# Altium project PCB.PrjPcb
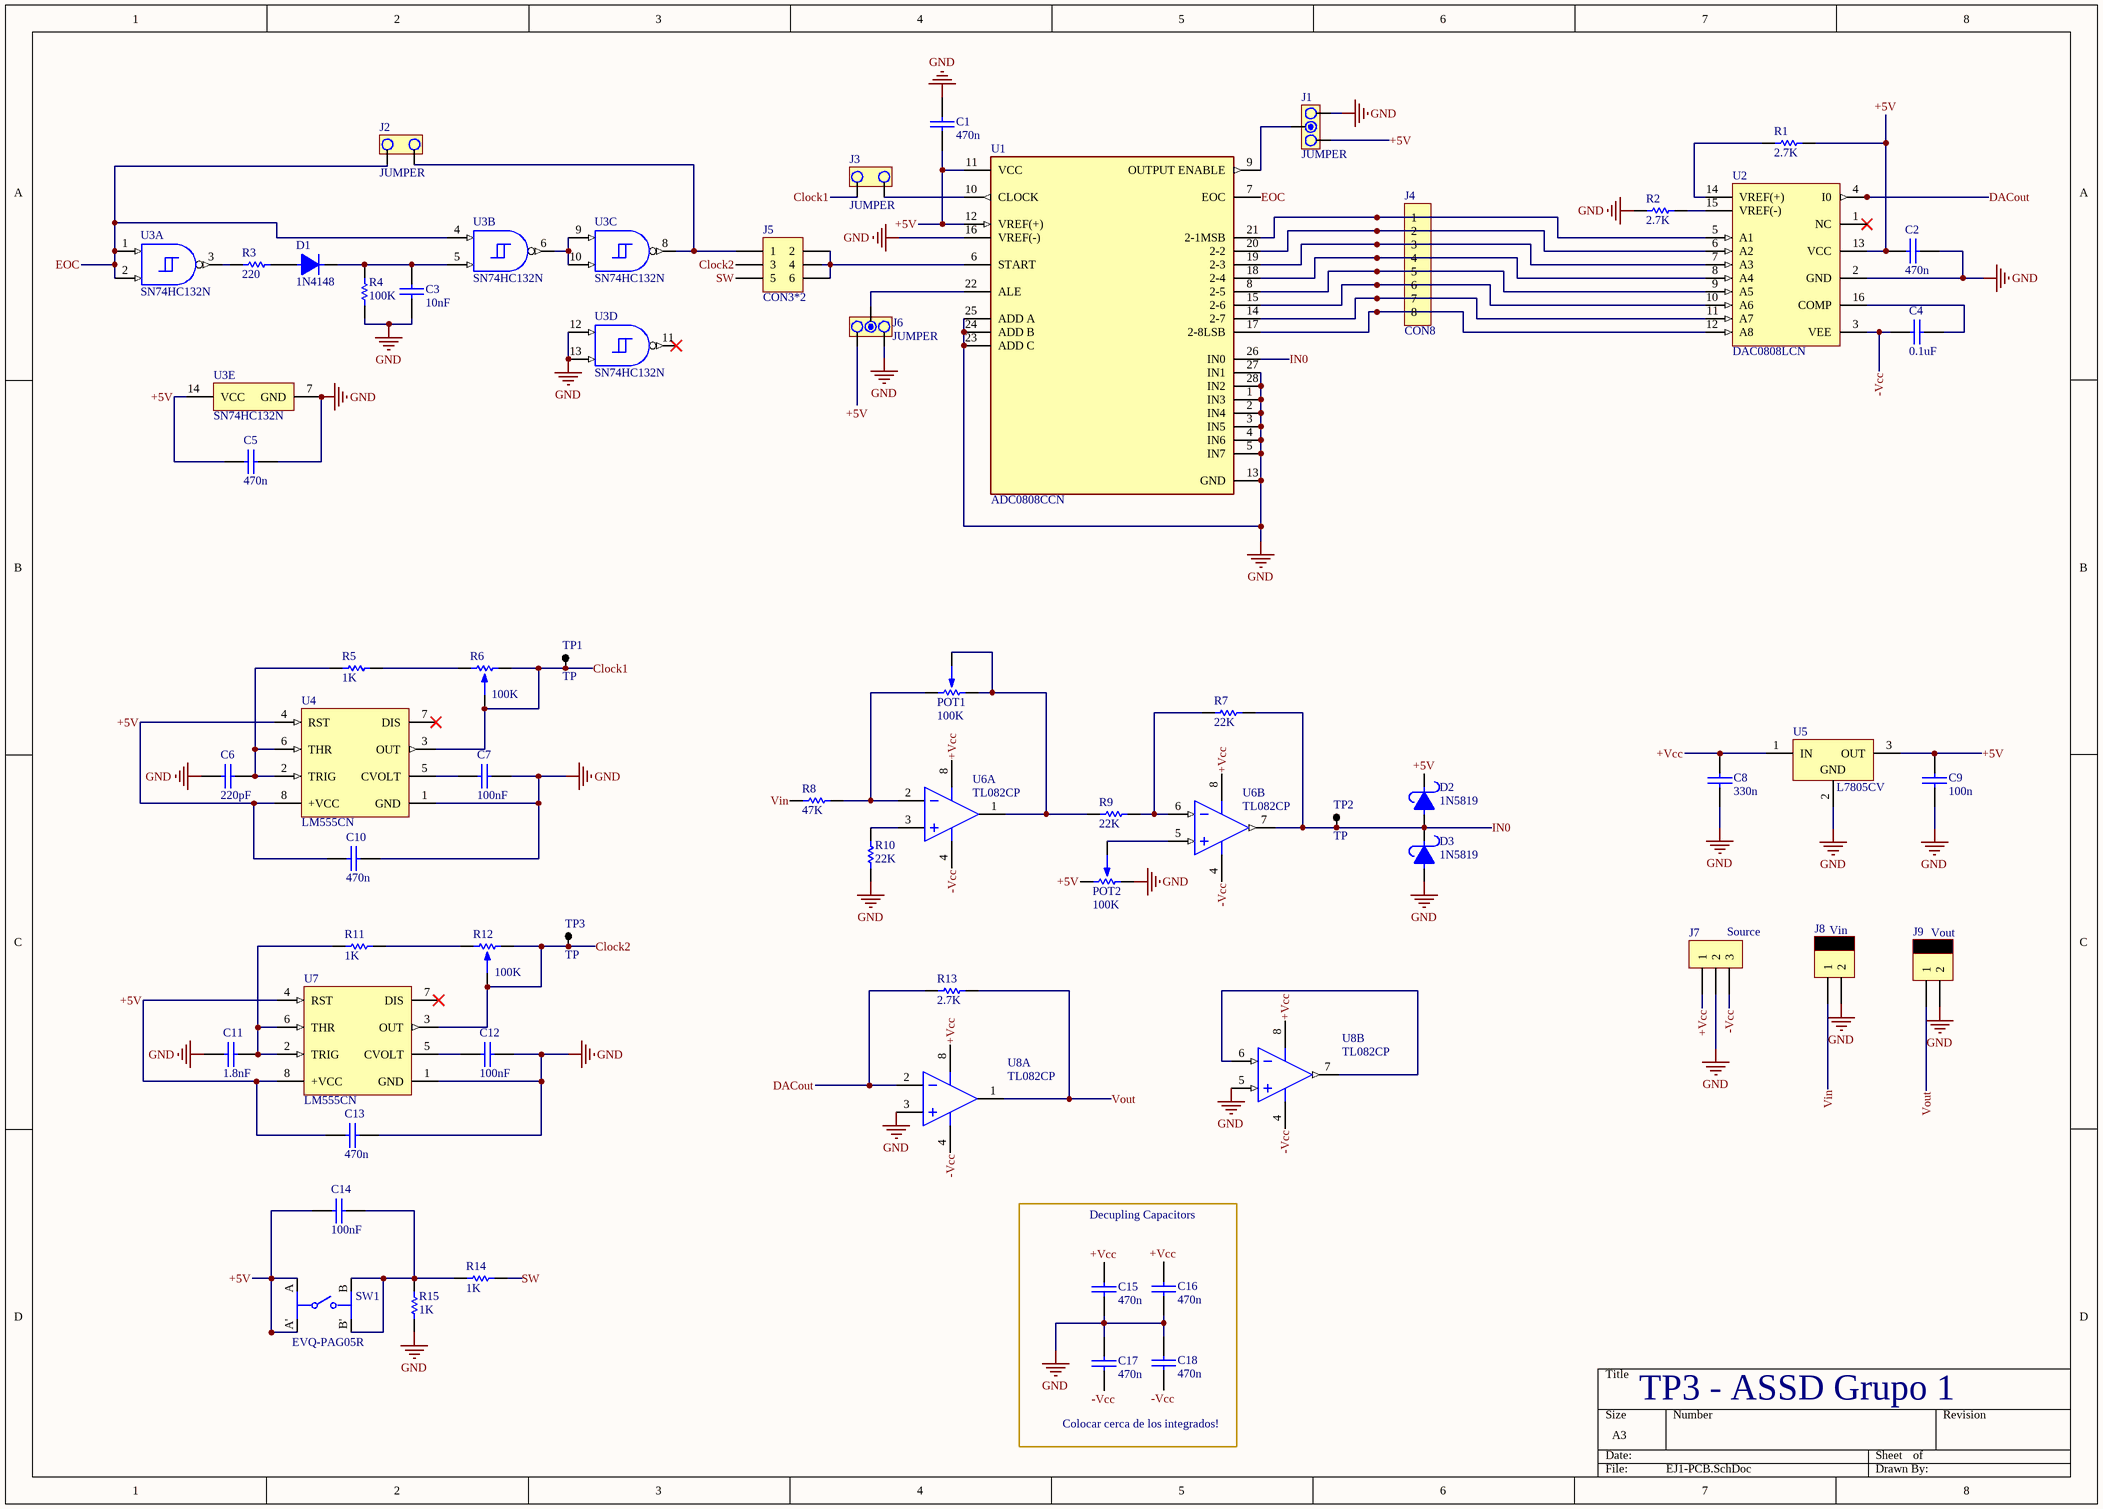
[diagram p0: EJ1-PCB.SchDoc]
1 sheet, 59 parts. Net scope: global (net labels, ports and power ports of the same name join across sheets).
Board file: EJ1-PCB.PcbDoc

## Sheet EJ1-PCB.SchDoc
size A3; SheetNumber: 1; SheetTotal: 1

### Parts
C1  470n  [0805]
C2  470n  [0805]
C3  10nF  [0805]
C4  0.1uF  [0805]
C5  470n  [0805]
C6  220pF  [0805]
C7  100nF  [0805]
C8  330n  [0805]
C9  100n  [0805]
C10  470n  [0805]
C11  1.8nF  [0805]
C12  100nF  [0805]
C13  470n  [0805]
C14  100nF  [0805]
C15  470n  [0805]
C16  470n  [0805]
C17  470n  [0805]
C18  470n  [0805]
D1  1N4148  [DO41]
D2  1N5819  [DO41]
D3  1N5819  [DO41]
J1  JUMPER  [JUMPER3]
J2  JUMPER  [JUMPER2]
J3  JUMPER  [JUMPER2]
J4  CON8  [SIP8]
J5  CON3*2  [SIP3*2]
J6  JUMPER  [JUMPER3]
J7  Source  [BORNERA3]
J8  Vin  [MOLEX2]
J9  Vout  [MOLEX2]
POT1  100K  [PRESET V]
POT2  100K  [PRESET V]
R1  2.7K  [0805]
R2  2.7K  [0805]
R3  220  [0805]
R4  100K  [0805]
R5  1K  [0805]
R6  100K  [PRESET V]
R7  22K  [0805]
R8  47K  [0805]
R9  22K  [0805]
R10  22K  [0805]
R11  1K  [0805]
R12  100K  [PRESET V]
R13  2.7K  [0805]
R14  1K  [0805]
R15  1K  [0805]
SW1  EVQ-PAG05R  [FP-EVQ-PAG05R-MFG]
TP1  TP  [TPTH]
TP2  TP  [TPTH]
TP3  TP  [TPTH]
U1  ADC0808CCN  [FP-N0028A-MFG]
U2  DAC0808LCN  [NFG0016A]
U3  SN74HC132N  [N0014A]  (parts A,B,C,D,E of 5)
U4  LM555CN  [N08E]
U5  L7805CV  [TO220]
U6  TL082CP  [P0008A]  (parts A,B of 2)
U7  LM555CN  [N08E]
U8  TL082CP  [P0008A]  (parts A,B of 2)

### Nets
GND: C1.1 C2.2 C3.2 C5.2 C6.2 C7.2 C8.2 C9.2 C10.2 C11.2 C12.2 C13.2 C15.2 C16.2 C17.1 C18.1 D3.1 J1.1 J6.1 J7.2 J8.2 J9.2 POT2.3 R2.1 R4.1 R10.2 R15.1 U1.1(IN3) U1.2(IN4) U1.3(IN5) U1.4(IN6) U1.5(IN7) U1.13(GND) U1.16(VREF(-)) U1.23(ADD_C) U1.24(ADD_B) U1.25(ADD_A) U1.27(IN1) U1.28(IN2) U2.2(GND) U3.7(GND) U3.12(4A) U3.13(4B) U4.1(GND) U5.2(GND) U7.1(GND) U8.3(IN1+) U8.5(IN2+)
+5V: C1.2 C2.1 C5.1 C9.1 C10.1 C13.1 C14.2 D2.2 J1.3 J6.3 POT2.1 R1.2 SW1.A SW1.A' U1.11(VCC) U1.12(VREF(+)) U2.13(VCC) U3.14(VCC) U4.4(RST) U4.8(+VCC) U5.3(OUT) U7.4(RST) U7.8(+VCC)
+Vcc: C8.1 C15.1 C16.1 J7.1 U5.1(IN) U6.8(VCC+) U8.8(VCC+)
-Vcc: C4.1 C17.2 C18.2 J7.3 U2.3(VEE) U6.4(VCC-) U8.4(VCC-)
Clock1: J3.2 R6.1 R6.2 TP1.1 U4.3(OUT)
Clock2: J5.3 R12.1 R12.2 TP3.1 U7.3(OUT)
DACout: R13.1 U2.4(I0) U8.2(IN1-)
EOC: J2.2 U1.7(EOC) U3.1(1A) U3.2(1B) U3.4(2A)
IN0: D2.1 D3.2 R7.2 TP2.1 U1.26(IN0) U6.7(OUT2)
SW: J5.5 R14.1
Vin: J8.1 R8.1
Vout: J9.1 R13.2 U8.1(OUT1)
NetC3_1: C3.1 D1.2 R4.2 U3.5(2B)
NetC4_2: C4.2 U2.16(COMP)
NetC6_1: C6.1 R5.1 U4.2(TRIG) U4.6(THR)
NetC7_1: C7.1 U4.5(CVOLT)
NetC11_1: C11.1 R11.1 U7.2(TRIG) U7.6(THR)
NetC12_1: C12.1 U7.5(CVOLT)
NetC14_1: C14.1 R14.2 R15.2 SW1.B SW1.B'
NetD1_1: D1.1 R3.2
NetJ1_2: J1.2 U1.9(OUTPUT_ENABLE)
NetJ2_1: J2.1 J5.1 U3.8(3Y)
NetJ3_1: J3.1 U1.10(CLOCK)
NetJ4_1: J4.1 U1.21(2-1MSB) U2.5(A1)
NetJ4_2: J4.2 U1.20(2-2) U2.6(A2)
NetJ4_3: J4.3 U1.19(2-3) U2.7(A3)
NetJ4_4: J4.4 U1.18(2-4) U2.8(A4)
NetJ4_5: J4.5 U1.8(2-5) U2.9(A5)
NetJ4_6: J4.6 U1.15(2-6) U2.10(A6)
NetJ4_7: J4.7 U1.14(2-7) U2.11(A7)
NetJ4_8: J4.8 U1.17(2-8LSB) U2.12(A8)
NetJ5_2: J5.2 J5.4 J5.6 U1.6(START)
NetJ6_2: J6.2 U1.22(ALE)
NetPOT1_1: POT1.1 R8.2 U6.2(IN1-)
NetPOT1_2: POT1.2 POT1.3 R9.1 U6.1(OUT1)
NetPOT2_2: POT2.2 U6.5(IN2+)
NetR1_1: R1.1 U2.14(VREF(+))
NetR2_2: R2.2 U2.15(VREF(-))
NetR3_1: R3.1 U3.3(1Y)
NetR5_2: R5.2 R6.3
NetR7_1: R7.1 R9.2 U6.6(IN2-)
NetR10_1: R10.1 U6.3(IN1+)
NetR11_2: R11.2 R12.3
NetU3_6: U3.6(2Y) U3.9(3A) U3.10(3B)
NetU8_6: U8.6(IN2-) U8.7(OUT2)

Not connected (* = marked no-connect by the designer): U2 1(NC)*; U3 11(4Y)*; U4 7(DIS)*; U7 7(DIS)*

### Notes on the sheet
- Decupling Capacitors
- Colocar cerca de los integrados!
- TP3 - ASSD Grupo 1

### Library data of the parts
C1-C18 = CAP
D1 = DIODO
D2 D3 = DIODO SCHOTTKY
J1 J6 = JUMPER3
J2 = JUMPER: Just in case HC132 does not work
J7 = BORNERA 3
J8 J9 = MOLEX2
POT1 POT2 R6 R12 = PRESET
R1-R5 R7-R11 R13-R15 = RES
SW1 = CMP-05618-000039-1: SWITCH TACTILE SPST-NO 0.02A 15V; Electrical Life: 50000Cycles; Actuator Color: Red; Switch Function: Off-Mom; Actuator Type: Standard; Max Current Rating: 20mA; Contact Resistance: 50mR; Operating Force: 2.6N; Switch Travel: 0.25mm; Illumination Type: Non-Illuminated; Throw Configuration: SPST; Actuator Length: 1.6mm; Max Operating Temperature: 70°C; Mount: Through Hole; RoHS Compliant: Yes; Depth: 6.5mm; Radiation Hardening: No; Orientation: Straight; Width: 6mm; REACH SVHC: No SVHC; Voltage Rating (DC): 15V; Package Quantity: 500; Size: 6mm; Max Voltage Rating (DC): 15V; Mechanical Life: 50000Cycles; Contact Current Rating: 20mA; Contact Plating: Silver; Lead Free: Lead Free; Series: EVQPA; Height: 5mm; Length: 6mm; Min Operating Temperature: -20°C; Current Rating: 20mA; Termination: PC Pin; Packaging: Bulk
U1 = CMP-0054-00026-4: IC ADC 8BIT MPU 8CH MUX 28-DIP; Supply Type: Single; Power Consumption: 1.5mW; Input Type: SINGLE-ENDED; Number of Channels: 8; Number of Converters: 1; Conversion Rate: 10KS/s; Min Supply Voltage: 4.5V; Converter Type: GENERAL PURPOSE; Power Dissipation: 875mW; Operating Supply Voltage: 5V; Nominal Supply Current: 300uA; Resolution: 8b; Max Supply Voltage: 6V; Interface: Parallel; Polarity: Unipolar; Packaging: Rail/Tube; Min Operating Temperature: -40°C; Number of Inputs: 8; Mount: Through Hole; Radiation Hardening: No; Number of A/D Converters: 1; Width: 13.72mm; Number of Elements: 1; Max Operating Temperature: 85°C; Max Power Dissipation: 875mW; REACH SVHC: No SVHC; Number of Analog Inputs: 8; Lead Free: Contains Lead; Number of Pins: 28; Sampling Rate: 10KS/s; Package Quantity: 13; Number of Bits: 8; Height: 3.81mm; Case/Package: DIP; Length: 36.83mm
U2 = CMP-0061-00001-3: 8-Bit D/A Converter, 16-pin MDIP; Manufacturer: Texas Instruments; PowerWise: N; PackageTopMarking: NSUZXYYTTE#*DAC0808LCN*MC1408P8; PackageDescription: MDIP, .750 x .250 x .130in, 16 Lead, .100in Pitch; ComponentLink1URL: http://www.ti.com/general/docs/lit/getliterature.tsp?genericPartNumber=DAC0808&fileType=pdf; ComponentLink1Description: Datasheet URL; PackageReference: NFG0016A; Code_JEDEC: MS-001-BB; RoHS: N; CompType: D/A Converter; PinCount: 16
U3 = CMP-1627-00473-3: Quadruple Positive-NAND Gates With Schmitt-Trigger Inputs, N0014A, TUBE; Manufacturer: Texas Instruments; Input Type: CMOS; Bits(#): 4; VCC(Min)(V): 2; Voltage(Nom)(V): 5; F @ Nom Voltage(Max)(Mhz): 70; ICC @ Nom Voltage(Max)(mA): 0.02; VCC(Max)(V): 6; Output Drive (IOL/IOH)(Max)(mA): 5.2/-5.2; tpd @ Nom Voltage(Max)(ns): 31; Technology Family: HC; Schmitt Trigger: Yes; Rating: Catalog; PackageReference: N0014A; Generic Part Number: SN74HC132; Code_JEDEC: MS-001; DatasheetVersion: SCLS034F; Operating Temperature Range(C): -40 to 85; Output Type: CMOS
U4 U7 = CMP-0056-00017-2: Timer, 8-pin MDIP; Manufacturer: National Semiconductor; CompType: Analog IC; PackageTopMarking: NSUZXYTTE#*LM*555CN; PowerWise: N; PackageReference: N08E; ComponentLink1Description: LM555 Datasheet; ComponentLink3URL: http://www.national.com/packaging/folders/n08e.html; ComponentLink1URL: http://www.national.com/ds/LM/LM555.pdf; ComponentLink2URL: http://www.national.com/pf/LM/LM555.html; PackageDescription: MDIP, .365 x .250 x .130in, 8 Lead, .100in Pitch; DatasheetVersion: Jul-2006; RevisionNote: Component URLs added; Code_JEDEC: MS-001-BA; PinCount: 8; ComponentLink3Description: N08E Package Page; PackageVersion: revG, May-2006; ComponentLink2Description: LM555 Web Page; RoHS: N
U5 = CMP-0244-00483-1: Positive Voltage Regulator, 5V, 3-Pin TO-220; PackageDescription: TO, Thru-Hole, Vertical, Heatsink Mounted; 3 In-Line Leads; Pitch 2.54 mm; ComponentLink2Description: Datasheet; PackageReference: TO220; ComponentLink3URL: http://www.st.com/internet/com/TECHNICAL_RESOURCES/TECHNICAL_LITERATURE/PACKAGE_INFORMATION/CD00004649.pdf; DatasheetVersion: 16/11/2011; ComponentLink1Description: Manufacturer URL; ComponentLink1URL: http://www.st.com; PackageVersion: ver3.0; ComponentLink3Description: Package Specification; ComponentLink2URL: http://www.st.com/internet/com/TECHNICAL_RESOURCES/TECHNICAL_LITERATURE/DATASHEET/CD00000444.pdf
U6 U8 = CMP-0055-00158-5: JFET-Input Operational Amplifier, 7 to 36 V, 0 to 70 degC, 8-pin DIP (P8), Pb-Free (RoHS); Manufacturer: Texas Instruments; Total Supply Voltage(Max)(+5V is 5, +/-5V is 10): 36; Rating: Catalog; Number of Channels: 2; Slew Rate(Typ)(V/us): 13; CMRR(Min)(dB): 70; Sub Family: General Purpose Amplifier, High Supply Voltage Amplifier (>=30V); Offset Drift(Typ)(uV/C): 18; Total Supply Voltage(Min)(+5V is 5, +/-5V is 10): 7; IIB(Max)(pA): 400; GBW(Typ)(MHz): 3; Iq per channel(Max)(mA): 2.8; Vio (25C)(Max)(mV): 15; PackageDescription: 8-Pin Plastic In-Line, Body 9.59 x 6.35 mm, Pitch 2.54 mm; ComponentLink2URL: http://www.ti.com/lit/ds/symlink/tl082.pdf; Mounting Technology: Through Hole; Code_JEDEC: MS-001; ComponentLink1Description: Manufacturer URL; ComponentLink3Description: Package Specification; PartNumber: TL082CP; PackageVersion: 4040082/E, 04/2010; Eco-Plan: Pb-Free (RoHS); ComponentLink1URL: http://www.ti.com/; PackageReference: P0008A; ComponentLink3URL: http://www.ti.com/litv/pdf/mpdi001b; DatasheetVersion: SLOS081G; ComponentLink2Description: Datasheet; Vn at 1kHz(Typ)(nV/rtHz): 18